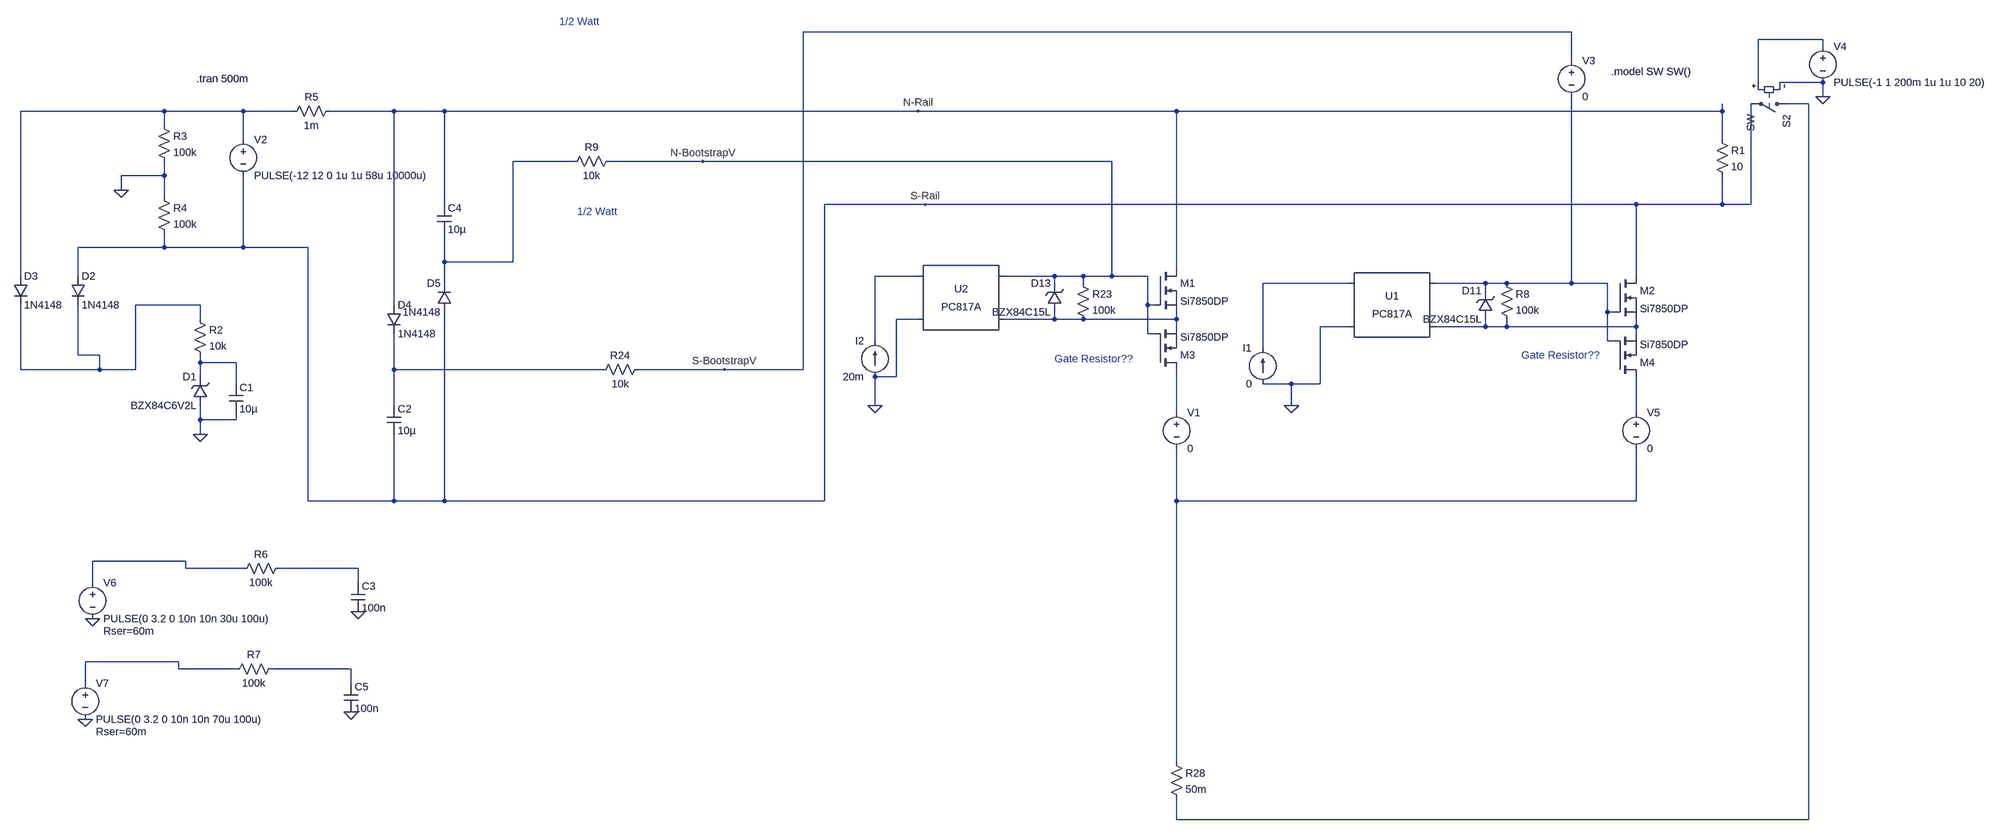
[diagram p0: schematic Tortoise.asc]
Tortoise.asc, the LTspice schematic file:
Version 4
SHEET 1 2824 2148
WIRE 336 -464 -1376 -464
WIRE 896 -448 752 -448
WIRE 896 -432 896 -448
WIRE 336 -400 336 -464
WIRE 752 -352 752 -448
WIRE 896 -352 800 -352
WIRE 896 -320 896 -352
WIRE 864 -304 816 -304
WIRE -2976 -288 -3296 -288
WIRE -2800 -288 -2976 -288
WIRE -2688 -288 -2800 -288
WIRE -2464 -288 -2608 -288
WIRE -2352 -288 -2464 -288
WIRE -1120 -288 -2352 -288
WIRE -544 -288 -1120 -288
WIRE 672 -288 672 -304
WIRE 672 -288 -544 -288
WIRE -2976 -256 -2976 -288
WIRE -2800 -224 -2800 -288
WIRE 672 -224 672 -288
WIRE -1904 -176 -2144 -176
WIRE -1616 -176 -1824 -176
WIRE -688 -176 -1616 -176
WIRE -2976 -144 -2976 -176
WIRE -2976 -144 -3072 -144
WIRE -3072 -112 -3072 -144
WIRE -2976 -96 -2976 -144
WIRE -2352 -80 -2352 -288
WIRE -1104 -80 -1328 -80
WIRE 480 -80 -1104 -80
WIRE 672 -80 672 -144
WIRE 672 -80 480 -80
WIRE 736 -80 736 -304
WIRE 736 -80 672 -80
WIRE -2976 16 -2976 -16
WIRE -2976 16 -3168 16
WIRE -2800 16 -2800 -144
WIRE -2800 16 -2976 16
WIRE -2656 16 -2800 16
WIRE -2352 48 -2352 -16
WIRE -2144 48 -2144 -176
WIRE -2144 48 -2352 48
WIRE -544 64 -544 -288
WIRE -3296 80 -3296 -288
WIRE -3168 80 -3168 16
WIRE -1120 80 -1216 80
WIRE -816 80 -928 80
WIRE -752 80 -816 80
WIRE -688 80 -688 -176
WIRE -688 80 -752 80
WIRE -608 80 -688 80
WIRE 480 80 480 -80
WIRE -2352 96 -2352 48
WIRE -816 96 -816 80
WIRE -752 96 -752 80
WIRE -160 96 -352 96
WIRE 144 96 32 96
WIRE 192 96 144 96
WIRE 336 96 336 -320
WIRE 336 96 192 96
WIRE 416 96 336 96
WIRE 144 112 144 96
WIRE -2896 144 -3040 144
WIRE -2464 144 -2464 -288
WIRE -608 144 -608 80
WIRE -592 144 -608 144
WIRE 416 160 416 96
WIRE 432 160 416 160
WIRE -2896 176 -2896 144
WIRE -1120 176 -1168 176
WIRE -816 176 -816 160
WIRE -816 176 -928 176
WIRE -752 176 -816 176
WIRE -544 176 -544 160
WIRE -544 176 -752 176
WIRE -544 192 -544 176
WIRE -160 192 -224 192
WIRE 144 192 144 176
WIRE 144 192 32 192
WIRE 192 192 192 176
WIRE 192 192 144 192
WIRE 480 192 480 176
WIRE 480 192 192 192
WIRE -608 208 -608 144
WIRE -592 208 -608 208
WIRE 480 208 480 192
WIRE -1216 224 -1216 80
WIRE 416 224 416 160
WIRE 432 224 416 224
WIRE -352 240 -352 96
WIRE -3168 256 -3168 144
WIRE -3120 256 -3168 256
WIRE -2896 272 -2896 256
WIRE -2816 272 -2896 272
WIRE -3296 288 -3296 144
WIRE -3120 288 -3120 256
WIRE -3120 288 -3296 288
WIRE -3040 288 -3040 144
WIRE -3040 288 -3120 288
WIRE -2464 288 -2464 208
WIRE -1840 288 -2464 288
WIRE -1568 288 -1760 288
WIRE -1376 288 -1376 -464
WIRE -1376 288 -1568 288
WIRE -2896 304 -2896 272
WIRE -1168 304 -1168 176
WIRE -1168 304 -1216 304
WIRE -2816 320 -2816 272
WIRE -288 320 -352 320
WIRE -224 320 -224 192
WIRE -224 320 -288 320
WIRE -2464 368 -2464 288
WIRE -1216 368 -1216 304
WIRE -288 368 -288 320
WIRE -544 384 -544 288
WIRE 480 384 480 304
WIRE -2896 400 -2896 368
WIRE -2816 400 -2816 384
WIRE -2816 400 -2896 400
WIRE -2896 432 -2896 400
WIRE -2656 592 -2656 16
WIRE -2464 592 -2464 432
WIRE -2464 592 -2656 592
WIRE -2352 592 -2352 160
WIRE -2352 592 -2464 592
WIRE -1328 592 -1328 -80
WIRE -1328 592 -2352 592
WIRE -544 592 -544 464
WIRE 480 592 480 464
WIRE 480 592 -544 592
WIRE -2928 800 -3136 800
WIRE -2928 816 -2928 800
WIRE -2800 816 -2928 816
WIRE -2544 816 -2720 816
WIRE -3136 848 -3136 800
WIRE -2544 848 -2544 816
WIRE -2944 1024 -3152 1024
WIRE -2944 1040 -2944 1024
WIRE -2816 1040 -2944 1040
WIRE -2560 1040 -2736 1040
WIRE -3152 1072 -3152 1024
WIRE -2560 1072 -2560 1040
WIRE -544 1248 -544 592
WIRE -544 1376 -544 1328
WIRE 864 1376 864 -304
WIRE 864 1376 -544 1376
FLAG -3072 -112 0
FLAG 896 -320 0
FLAG -1616 -176 N-BootstrapV
FLAG -1568 288 S-BootstrapV
FLAG -1120 -288 N-Rail
FLAG -1104 -80 S-Rail
FLAG -288 368 0
FLAG -1216 368 0
FLAG -2896 432 0
FLAG -2544 912 0
FLAG -3136 928 0
FLAG -2560 1136 0
FLAG -3152 1152 0
SYMBOL nmos -592 64 R0
SYMATTR InstName M1
SYMATTR Value Si7850DP
SYMBOL nmos 432 80 R0
SYMATTR InstName M2
SYMATTR Value Si7850DP
SYMBOL nmos -592 288 M180
SYMATTR InstName M3
SYMATTR Value Si7850DP
SYMBOL nmos 432 304 M180
SYMATTR InstName M4
SYMATTR Value Si7850DP
SYMBOL voltage -2800 -240 R0
WINDOW 123 0 0 Left 2
WINDOW 39 0 0 Left 2
SYMATTR InstName V2
SYMATTR Value PULSE(-12 12 0 1u 1u 58u 10000u)
SYMBOL res 656 -240 R0
SYMATTR InstName R1
SYMATTR Value 10
SYMBOL res -2992 -272 R0
SYMATTR InstName R3
SYMATTR Value 100k
SYMBOL res -2992 -112 R0
SYMATTR InstName R4
SYMATTR Value 100k
SYMBOL voltage 896 -448 R0
WINDOW 123 0 0 Left 2
WINDOW 39 0 0 Left 2
SYMATTR InstName V4
SYMATTR Value PULSE(-1 1 200m 1u 1u 10 20)
SYMBOL sw 832 -304 R90
SYMATTR InstName S2
SYMBOL res -2592 -304 R90
WINDOW 0 0 56 VBottom 2
WINDOW 3 32 56 VTop 2
SYMATTR InstName R5
SYMATTR Value 1m
SYMBOL res 176 80 R0
SYMATTR InstName R8
SYMATTR Value 100k
SYMBOL zener 160 176 R180
WINDOW 0 24 64 Left 2
WINDOW 3 24 0 Left 2
SYMATTR InstName D11
SYMATTR Value BZX84C15L
SYMATTR Description Diode
SYMATTR Type diode
SYMBOL res -768 80 R0
SYMATTR InstName R23
SYMATTR Value 100k
SYMBOL res -1744 272 R90
WINDOW 0 0 56 VBottom 2
WINDOW 3 32 56 VTop 2
SYMATTR InstName R24
SYMATTR Value 10k
SYMBOL zener -800 160 R180
WINDOW 0 24 64 Left 2
WINDOW 3 24 0 Left 2
SYMATTR InstName D13
SYMATTR Value BZX84C15L
SYMATTR Description Diode
SYMATTR Type diode
SYMBOL current -352 320 R180
WINDOW 0 24 80 Left 2
WINDOW 3 24 0 Left 2
WINDOW 123 0 0 Left 2
WINDOW 39 0 0 Left 2
SYMATTR InstName I1
SYMATTR Value 0
SYMBOL voltage 336 -416 R0
WINDOW 123 0 0 Left 2
WINDOW 39 0 0 Left 2
SYMATTR InstName V3
SYMATTR Value 0
SYMBOL Optos\\PC817A -64 144 R0
SYMATTR InstName U1
SYMBOL res -560 1232 R0
SYMATTR InstName R28
SYMATTR Value 50m
SYMBOL current -1216 304 R180
WINDOW 0 24 80 Left 2
WINDOW 3 24 0 Left 2
WINDOW 123 0 0 Left 2
WINDOW 39 0 0 Left 2
SYMATTR InstName I2
SYMATTR Value 20m
SYMBOL Optos\\PC817A -1024 128 R0
SYMATTR InstName U2
SYMBOL voltage -544 368 R0
WINDOW 123 0 0 Left 2
WINDOW 39 0 0 Left 2
SYMATTR InstName V1
SYMATTR Value 0
SYMBOL voltage 480 368 R0
WINDOW 123 0 0 Left 2
WINDOW 39 0 0 Left 2
SYMATTR InstName V5
SYMATTR Value 0
SYMBOL cap -2480 368 R0
SYMATTR InstName C2
SYMATTR Value 10µ
SYMBOL diode -2480 144 R0
SYMATTR InstName D4
SYMATTR Value 1N4148
SYMBOL cap -2368 -80 R0
SYMATTR InstName C4
SYMATTR Value 10µ
SYMBOL diode -2336 160 R180
WINDOW 0 24 64 Left 2
WINDOW 3 24 0 Left 2
SYMATTR InstName D5
SYMATTR Value 1N4148
SYMBOL res -1808 -192 R90
WINDOW 0 0 56 VBottom 2
WINDOW 3 32 56 VTop 2
SYMATTR InstName R9
SYMATTR Value 10k
SYMBOL zener -2880 368 R180
WINDOW 0 24 64 Left 2
WINDOW 3 24 0 Left 2
SYMATTR InstName D1
SYMATTR Value BZX84C6V2L
SYMATTR Description Diode
SYMATTR Type diode
SYMBOL res -2912 160 R0
SYMATTR InstName R2
SYMATTR Value 10k
SYMBOL diode -3312 80 R0
SYMATTR InstName D3
SYMATTR Value 1N4148
SYMBOL diode -3184 80 R0
SYMATTR InstName D2
SYMATTR Value 1N4148
SYMBOL cap -2832 320 R0
SYMATTR InstName C1
SYMATTR Value 10µ
SYMBOL voltage -3136 832 R0
WINDOW 123 0 0 Left 2
WINDOW 39 24 124 Left 2
SYMATTR SpiceLine Rser=60m
SYMATTR InstName V6
SYMATTR Value PULSE(0 3.2 0 10n 10n 30u 100u)
SYMBOL res -2704 800 R90
WINDOW 0 0 56 VBottom 2
WINDOW 3 32 56 VTop 2
SYMATTR InstName R6
SYMATTR Value 100k
SYMBOL cap -2560 848 R0
SYMATTR InstName C3
SYMATTR Value 100n
SYMBOL voltage -3152 1056 R0
WINDOW 123 0 0 Left 2
WINDOW 39 24 124 Left 2
SYMATTR SpiceLine Rser=60m
SYMATTR InstName V7
SYMATTR Value PULSE(0 3.2 0 10n 10n 70u 100u)
SYMBOL res -2720 1024 R90
WINDOW 0 0 56 VBottom 2
WINDOW 3 32 56 VTop 2
SYMATTR InstName R7
SYMATTR Value 100k
SYMBOL cap -2576 1072 R0
SYMATTR InstName C5
SYMATTR Value 100n
TEXT -2904 -360 Left 2 !.tran 500m
TEXT 424 -376 Left 2 !.model SW SW()
TEXT -816 264 Left 2 ;Gate Resistor??
TEXT 224 256 Left 2 ;Gate Resistor??
TEXT -1936 -488 Left 2 ;1/2 Watt
TEXT -1896 -64 Left 2 ;1/2 Watt

The netlist it stands for:
* Tortoise.asc
M1 N-Rail N-BootstrapV N009 N009 Si7850DP
M2 S-Rail N007 N010 N010 Si7850DP
M3 N013 N-BootstrapV N009 N009 Si7850DP
M4 N014 N007 N010 N010 Si7850DP
V2 N003 S-Rail PULSE(-12 12 0 1u 1u 58u 10000u)
R1 N-Rail S-Rail 10
R3 N003 0 100k
R4 0 S-Rail 100k
V4 N001 0 PULSE(-1 1 200m 1u 1u 10 20)
S2 N002 S-Rail N001 0 SW
R5 N-Rail N003 1m
R8 N007 N010 100k
D11 N010 N007 BZX84C15L
R23 N-BootstrapV N009 100k
R24 S-BootstrapV N012 10k
D13 N009 N-BootstrapV BZX84C15L
I1 0 N006 0
V3 S-BootstrapV N007 0
XU1 N006 0 N007 N010 PC817 Igain=1m
R28 N015 N002 50m
I2 0 N005 20m
XU2 N005 0 N-BootstrapV N009 PC817 Igain=1m
V1 N013 N015 0
V5 N014 N015 0
C2 N012 S-Rail 10µ
D4 N-Rail N012 1N4148
C4 N-Rail N004 10µ
D5 S-Rail N004 1N4148
R9 N-BootstrapV N004 10k
D1 0 N011 BZX84C6V2L
R2 N008 N011 10k
D3 N003 N008 1N4148
D2 S-Rail N008 1N4148
C1 N011 0 10µ
V6 N016 0 PULSE(0 3.2 0 10n 10n 30u 100u) Rser=60m
R6 N017 N016 100k
C3 N017 0 100n
V7 N018 0 PULSE(0 3.2 0 10n 10n 70u 100u) Rser=60m
R7 N019 N018 100k
C5 N019 0 100n
.model D D
.lib standard.dio
.model NMOS NMOS
.model PMOS PMOS
.lib standard.mos
.tran 500m
.model SW SW()
* Gate Resistor??
* Gate Resistor??
* 1/2 Watt
* 1/2 Watt
.lib PC817.sub
.backanno
.end